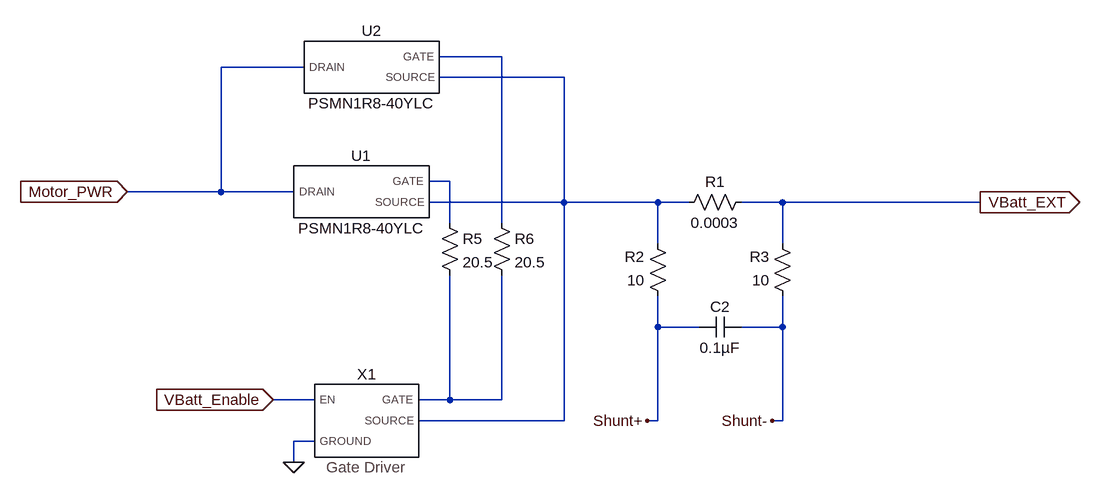
[diagram p0: schematic VBatt.asc]
VBatt.asc, the LTspice schematic file:
Version 4
SHEET 1 1784 680
WIRE 400 -128 304 -128
WIRE 96 -112 -32 -112
WIRE 496 -96 304 -96
WIRE 320 64 288 64
WIRE -32 80 -32 -112
WIRE -32 80 -176 80
WIRE 80 80 -32 80
WIRE 496 96 496 -96
WIRE 496 96 288 96
WIRE 640 96 496 96
WIRE 688 96 640 96
WIRE 832 96 768 96
WIRE 1136 96 832 96
WIRE 320 128 320 64
WIRE 400 128 400 -128
WIRE 640 160 640 96
WIRE 832 160 832 96
WIRE 640 288 640 240
WIRE 704 288 640 288
WIRE 832 288 832 240
WIRE 832 288 768 288
WIRE 112 400 48 400
WIRE 320 400 320 208
WIRE 320 400 272 400
WIRE 400 400 400 208
WIRE 400 400 320 400
WIRE 496 432 496 96
WIRE 496 432 272 432
WIRE 640 432 640 288
WIRE 640 432 624 432
WIRE 832 432 832 288
WIRE 832 432 816 432
WIRE 112 464 80 464
WIRE 80 496 80 464
FLAG -176 80 Motor_PWR
IOPIN -176 80 In
FLAG 1136 96 VBatt_EXT
IOPIN 1136 96 Out
FLAG 80 496 0
FLAG 48 400 VBatt_Enable
IOPIN 48 400 In
FLAG 624 432 Shunt+
FLAG 816 432 Shunt-
DATAFLAG -32 0 ""
SYMBOL AutoGenerated\\PSMN1R8-40YLC 176 80 R0
SYMATTR InstName U1
SYMBOL AutoGenerated\\PSMN1R8-40YLC 192 -112 R0
SYMATTR InstName U2
SYMBOL res 784 80 R90
WINDOW 0 0 56 VBottom 2
WINDOW 3 32 56 VTop 2
SYMATTR InstName R1
SYMATTR Value 0.0003
SYMBOL res 656 256 R180
WINDOW 0 36 76 Left 2
WINDOW 3 36 40 Left 2
SYMATTR InstName R2
SYMATTR Value 10
SYMBOL res 848 256 R180
WINDOW 0 36 76 Left 2
WINDOW 3 36 40 Left 2
SYMATTR InstName R3
SYMATTR Value 10
SYMBOL cap 768 272 R90
WINDOW 0 0 32 VBottom 2
WINDOW 3 32 32 VTop 2
SYMATTR InstName C2
SYMATTR Value 0.1µF
SYMBOL res 304 112 R0
SYMATTR InstName R5
SYMATTR Value 20.5
SYMATTR SpiceLine tol=1
SYMBOL res 384 112 R0
SYMATTR InstName R6
SYMATTR Value 20.5
SYMATTR SpiceLine tol=1
SYMBOL gatedriver 192 432 R0
SYMATTR InstName X1

The netlist it stands for:
* VBatt.asc
XU1 Motor_PWR N003 N002 PSMN1R8-40YLC  ; pins DRAIN GATE SOURCE
XU2 Motor_PWR N001 N002 PSMN1R8-40YLC  ; pins DRAIN GATE SOURCE
R1 VBatt_EXT N002 0.0003
R2 Shunt+ N002 10
R3 Shunt- VBatt_EXT 10
C2 Shunt- Shunt+ 0.1µF
R5 N003 N004 20.5 tol=1
R6 N001 N004 20.5 tol=1
XX1 VBatt_Enable N004 0 N002 gatedriver  ; pins EN GATE GROUND SOURCE
.lib C:\Poorna\OneDrive - University of Victoria\University\2020\Summer 2020\ECE 499\Schematic\LTSpice\models\PSMN1R8-40YLC.lib
.backanno
.end